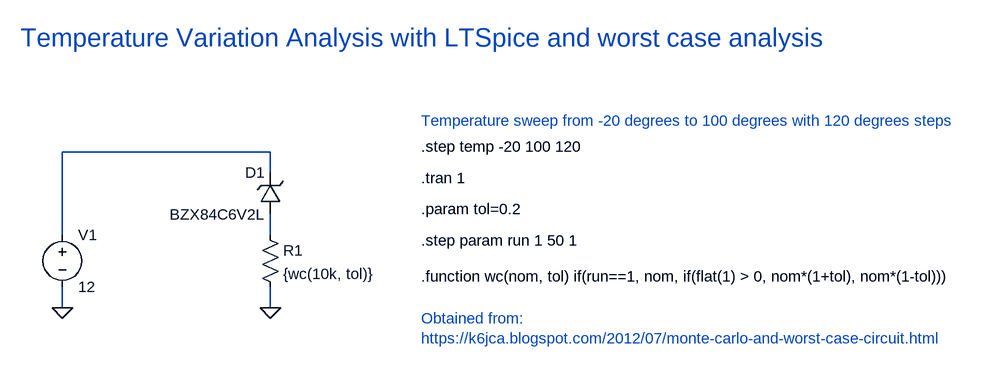
[diagram p0: schematic Temperature-Variation-and-Worst-case-LTSpice.asc]
Temperature-Variation-and-Worst-case-LTSpice.asc, the LTspice schematic file:
Version 4
SHEET 1 1320 680
WIRE 224 -32 -96 -32
WIRE 224 0 224 -32
WIRE -96 96 -96 -32
WIRE 224 96 224 64
WIRE -96 208 -96 176
WIRE 224 208 224 176
FLAG 224 208 0
FLAG -96 208 0
SYMBOL voltage -96 80 R0
WINDOW 123 0 0 Left 0
WINDOW 39 0 0 Left 0
SYMATTR InstName V1
SYMATTR Value 12
SYMBOL res 208 80 R0
SYMATTR InstName R1
SYMATTR Value {wc(10k, tol)}
SYMBOL zener 240 64 R180
WINDOW 0 24 64 Left 2
WINDOW 3 24 0 Left 2
SYMATTR InstName D1
SYMATTR Value BZX84C6V2L
SYMATTR Description Diode
SYMATTR Type diode
TEXT 456 -40 Left 2 !.step temp -20 100 120
TEXT 456 8 Left 2 !.tran 1
TEXT -160 -208 Left 4 ;Temperature Variation Analysis with LTSpice and worst case analysis
TEXT 456 -80 Left 2 ;Temperature sweep from -20 degrees to 100 degrees with 120 degrees steps
TEXT 456 56 Left 2 !.param tol=0.2
TEXT 456 104 Left 2 !.step param run 1 50 1
TEXT 456 160 Left 2 !.function wc(nom, tol) if(run==1, nom, if(flat(1) > 0, nom*(1+tol), nom*(1-tol)))
TEXT 456 224 Left 2 ;Obtained from:\nhttps://k6jca.blogspot.com/2012/07/monte-carlo-and-worst-case-circuit.html

The netlist it stands for:
* Temperature-Variation-and-Worst-case-LTSpice.asc
V1 N001 0 12
R1 N002 0 {wc(10k, tol)}
D1 N002 N001 BZX84C6V2L
.model D D
.lib standard.dio
.step temp -20 100 120
.tran 1
* Temperature Variation Analysis with LTSpice and worst case analysis
* Temperature sweep from -20 degrees to 100 degrees with 120 degrees steps
.param tol=0.2
.step param run 1 50 1
.function wc(nom, tol) if(run==1, nom, if(flat(1) > 0, nom*(1+tol), nom*(1-tol)))
* Obtained from:
* https://k6jca.blogspot.com/2012/07/monte-carlo-and-worst-case-circuit.html
.backanno
.end